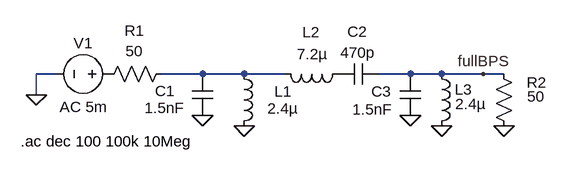
[diagram p0: schematic BPSTest.asc]
BPSTest.asc, the LTspice schematic file:
Version 4
SHEET 1 880 680
WIRE -112 128 -144 128
WIRE 112 128 48 128
WIRE 176 128 112 128
WIRE 240 128 176 128
WIRE 432 128 384 128
WIRE 480 128 432 128
WIRE 544 128 480 128
WIRE 576 128 544 128
WIRE -144 160 -144 128
FLAG 112 192 0
FLAG 176 208 0
FLAG 432 192 0
FLAG 480 208 0
FLAG 576 208 0
FLAG 544 128 fullBPS
FLAG -144 160 0
SYMBOL res 64 112 R90
WINDOW 0 -35 57 VBottom 2
WINDOW 3 -35 57 VTop 2
SYMATTR InstName R1
SYMATTR Value 50
SYMBOL cap 96 128 R0
WINDOW 0 -57 26 Left 2
WINDOW 3 -73 52 Left 2
SYMATTR InstName C1
SYMATTR Value 1.5nF
SYMBOL ind 160 112 R0
WINDOW 0 63 43 Left 2
WINDOW 3 52 69 Left 2
SYMATTR InstName L1
SYMATTR Value 2.4µ
SYMBOL ind 336 112 R90
WINDOW 0 -33 57 VBottom 2
WINDOW 3 -30 55 VTop 2
SYMATTR InstName L2
SYMATTR Value 7.2µ
SYMBOL cap 384 112 R90
WINDOW 0 -34 34 VBottom 2
WINDOW 3 -33 33 VTop 2
SYMATTR InstName C2
SYMATTR Value 470p
SYMBOL cap 448 192 R180
WINDOW 0 45 37 Left 2
WINDOW 3 43 9 Left 2
SYMATTR InstName C3
SYMATTR Value 1.5nF
SYMBOL ind 464 112 R0
WINDOW 3 37 62 Left 2
SYMATTR Value 2.4µ
SYMATTR InstName L3
SYMBOL res 560 112 R0
WINDOW 0 51 29 Left 2
WINDOW 3 52 51 Left 2
SYMATTR InstName R2
SYMATTR Value 50
SYMBOL voltage -16 128 R90
WINDOW 0 -32 56 VBottom 2
WINDOW 3 32 56 VTop 2
WINDOW 123 35 55 VTop 2
WINDOW 39 0 0 Left 0
SYMATTR InstName V1
SYMATTR Value ""
SYMATTR Value2 AC 5m
TEXT -168 232 Left 2 !.ac dec 100 100k 10Meg

The netlist it stands for:
* BPSTest.asc
R1 N001 P001 50
C1 N001 0 1.5nF
L1 N001 0 2.4µ
L2 P002 N001 7.2µ
C2 fullBPS P002 470p
C3 0 fullBPS 1.5nF
L3 fullBPS 0 2.4µ
R2 fullBPS 0 50
V1 P001 0 AC 5m
.ac dec 100 100k 10Meg
.backanno
.end